# EAGLE design pcg_quad (EAGLE 9.6.2)
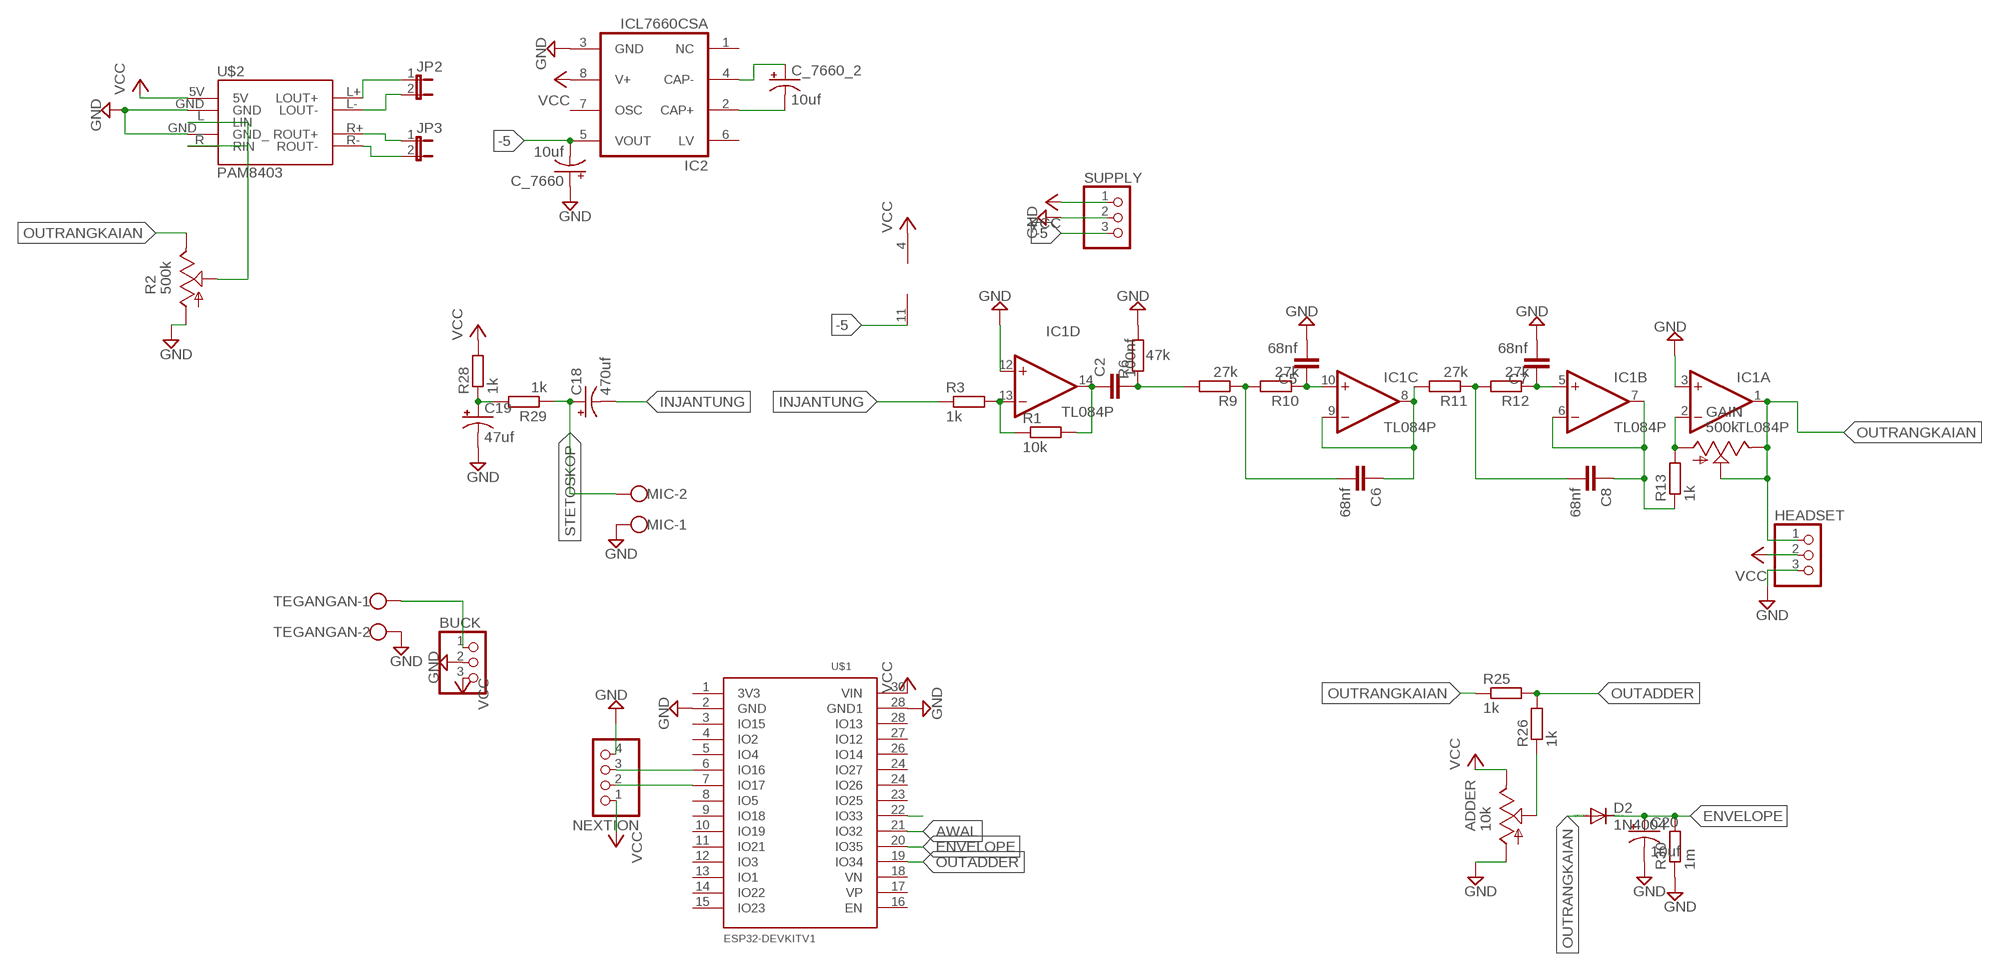
[diagram p0: schematic, sheet 1]

## Parts
ADDER  10k  TRIM_US-B64Y  [B64Y]
BUCK  PINHD-1X3  [1X03]
C2  100nf  C-EU050-025X075  [C050-025X075]
C5  68nf  C-EU050-025X075  [C050-025X075]
C6  68nf  C-EU050-025X075  [C050-025X075]
C7  68nf  C-EU050-025X075  [C050-025X075]
C8  68nf  C-EU050-025X075  [C050-025X075]
C18  470uf  CPOL-USE2.5-7  [E2,5-7]
C19  47uf  CPOL-USE2-5  [E2-5]
C20  10uf  CPOL-USE2-5  [E2-5]
C_7660  10uf  CPOL-USE2-5  [E2-5]
C_7660_2  10uf  CPOL-USE2-5  [E2-5]
D2  1N4004  [DO41-10]
GAIN  500k  TRIM_US-B64Y  [B64Y]
HEADSET  PINHD-1X3  [1X03]
IC1  TL084P  [DIL14]
IC2  ICL7660CSA  [SO08]
JP2  JP1E  [JP1]
JP3  JP1E  [JP1]
MIC  W237-102  [W237-102]
NEXTION  PINHD-1X4  [1X04]
R1  10k  R-EU_0309/10  [0309/10]
R2  500k  TRIM_US-B64Y  [B64Y]
R3  1k  R-EU_0309/10  [0309/10]
R6  47k  R-EU_0309/10  [0309/10]
R9  27k  R-EU_0309/10  [0309/10]
R10  27k  R-EU_0309/10  [0309/10]
R11  27k  R-EU_0309/10  [0309/10]
R12  27k  R-EU_0309/10  [0309/10]
R13  1k  R-EU_0309/10  [0309/10]
R25  1k  R-EU_0309/10  [0309/10]
R26  1k  R-EU_0309/10  [0309/10]
R28  1k  R-EU_0309/10  [0309/10]
R29  1k  R-EU_0309/10  [0309/10]
R30  1m  R-EU_0309/10  [0309/10]
SUPPLY  PINHD-1X3  [1X03]
TEGANGAN  W237-102  [W237-102]
U$1  ESP32DEVKITV1  [ESP32-DEVKITV1]
U$2  PAM8403  [PAM8403]

## Nets
-5: C_7660.- IC1.11(P:V-) IC2.5(VOUT) SUPPLY.3
AWAL: U$1.21(IO32)
ENVELOPE: C20.+ D2.C R30.2 U$1.20(IO35)
GND: ADDER.A BUCK.2 C5.2 C7.2 C19.- C20.- C_7660.+ HEADSET.3 IC1.3(A:+IN) IC1.12(D:+IN) IC2.3(GND) MIC.1 NEXTION.4 R2.A R6.2 R30.1 SUPPLY.2 TEGANGAN.2 U$1.2(GND) U$1.28(GND1) U$2.GND U$2.GND_
INJANTUNG: C18.- R3.1
N$1: IC1.13(D:-IN) R1.1 R3.2
N$2: C_7660_2.+ IC2.4(CAP-)
N$3: BUCK.1 TEGANGAN.1
N$4: R2.S U$2.L(LIN) U$2.R(RIN)
N$5: JP2.1 U$2.L+(LOUT+)
N$6: C_7660_2.- IC2.2(CAP+)
N$8: C2.2 R6.1 R9.2
N$9: NEXTION.3 U$1.6(IO16)
N$10: NEXTION.2 U$1.7(IO17)
N$11: JP2.2 U$2.L-(LOUT-)
N$12: JP3.1 U$2.R+(ROUT+)
N$13: C6.2 R9.1 R10.2
N$14: C5.1 IC1.10(C:+IN) R10.1
N$15: C6.1 IC1.8(C:OUT) IC1.9(C:-IN) R11.2
N$16: C8.2 R11.1 R12.2
N$17: C7.1 IC1.5(B:+IN) R12.1
N$18: C8.1 IC1.6(B:-IN) IC1.7(B:OUT) R13.1
N$19: GAIN.A IC1.2(A:-IN) R13.2
N$20: JP3.2 U$2.R-(ROUT-)
N$24: U$1.22(IO33)
N$38: ADDER.S R26.1
N$39: C19.+ R28.1 R29.2
OUTADDER: R25.2 R26.2 U$1.19(IO34)
OUTRANGKAIAN: D2.A GAIN.E GAIN.S HEADSET.1 IC1.1(A:OUT) R2.E R25.1
STETOSKOP: C18.+ MIC.2 R29.1
TEST: C2.1 IC1.14(D:OUT) R1.2
VCC: ADDER.E BUCK.3 HEADSET.2 IC1.4(P:V+) IC2.8(V+) NEXTION.1 R28.2 SUPPLY.1 U$1.30(VIN) U$2.5V
Unconnected: IC2.1(NC) IC2.6(LV) IC2.7(OSC) U$1.1(3V3) U$1.3(IO15) U$1.4(IO2) U$1.5(IO4) U$1.8(IO5) U$1.9(IO18) U$1.10(IO19) U$1.11(IO21) U$1.12(IO3) U$1.13(IO1) U$1.14(IO22) U$1.15(IO23) U$1.16(EN) U$1.17(VP) U$1.18(VN) U$1.23(IO25) U$1.24(IO26) U$1.24(IO27) U$1.26(IO14) U$1.27(IO12) U$1.28(IO13)

## Library data of the parts
ADDER GAIN R2 = pot:TRIM_US-: POTENTIOMETER
BUCK HEADSET SUPPLY = pinhead:PINHD-1X3: PIN HEADER
C2 C5-C8 = rcl:C-EU: CAPACITOR, European symbol; SPICEPREFIX: C
C18-C20 C_7660 C_7660_2 = rcl:CPOL-US: POLARIZED CAPACITOR, American symbol; SPICEPREFIX: C
D2 = diode:1N4004: DIODE general purpose rectifier, 1 A
IC1 = linear:TL084: OP AMP
IC2 = maxim:ICL7660CSA: VOLTAGE CONVERTER; MF: MAXIM; MPN: ICL7660CSA; OC_FARNELL: 9724710; OC_NEWARK: 34C3732
JP2 JP3 = jumper:JP1E: JUMPER
MIC TEGANGAN = con-wago-500:W237-102: WAGO SCREW CLAMP; MPN: 237-102; OC_FARNELL: unknown; OC_NEWARK: 70K9898
NEXTION = pinhead:PINHD-1X4: PIN HEADER
R1 R3 R6 R9-R13 R25 R26 R28-R30 = rcl:R-EU_: RESISTOR, European symbol; SPICEPREFIX: R
U$1 = ESP32-DEVKITV1:ESP32DEVKITV1
U$2 = pam8403:PAM8403

## Board
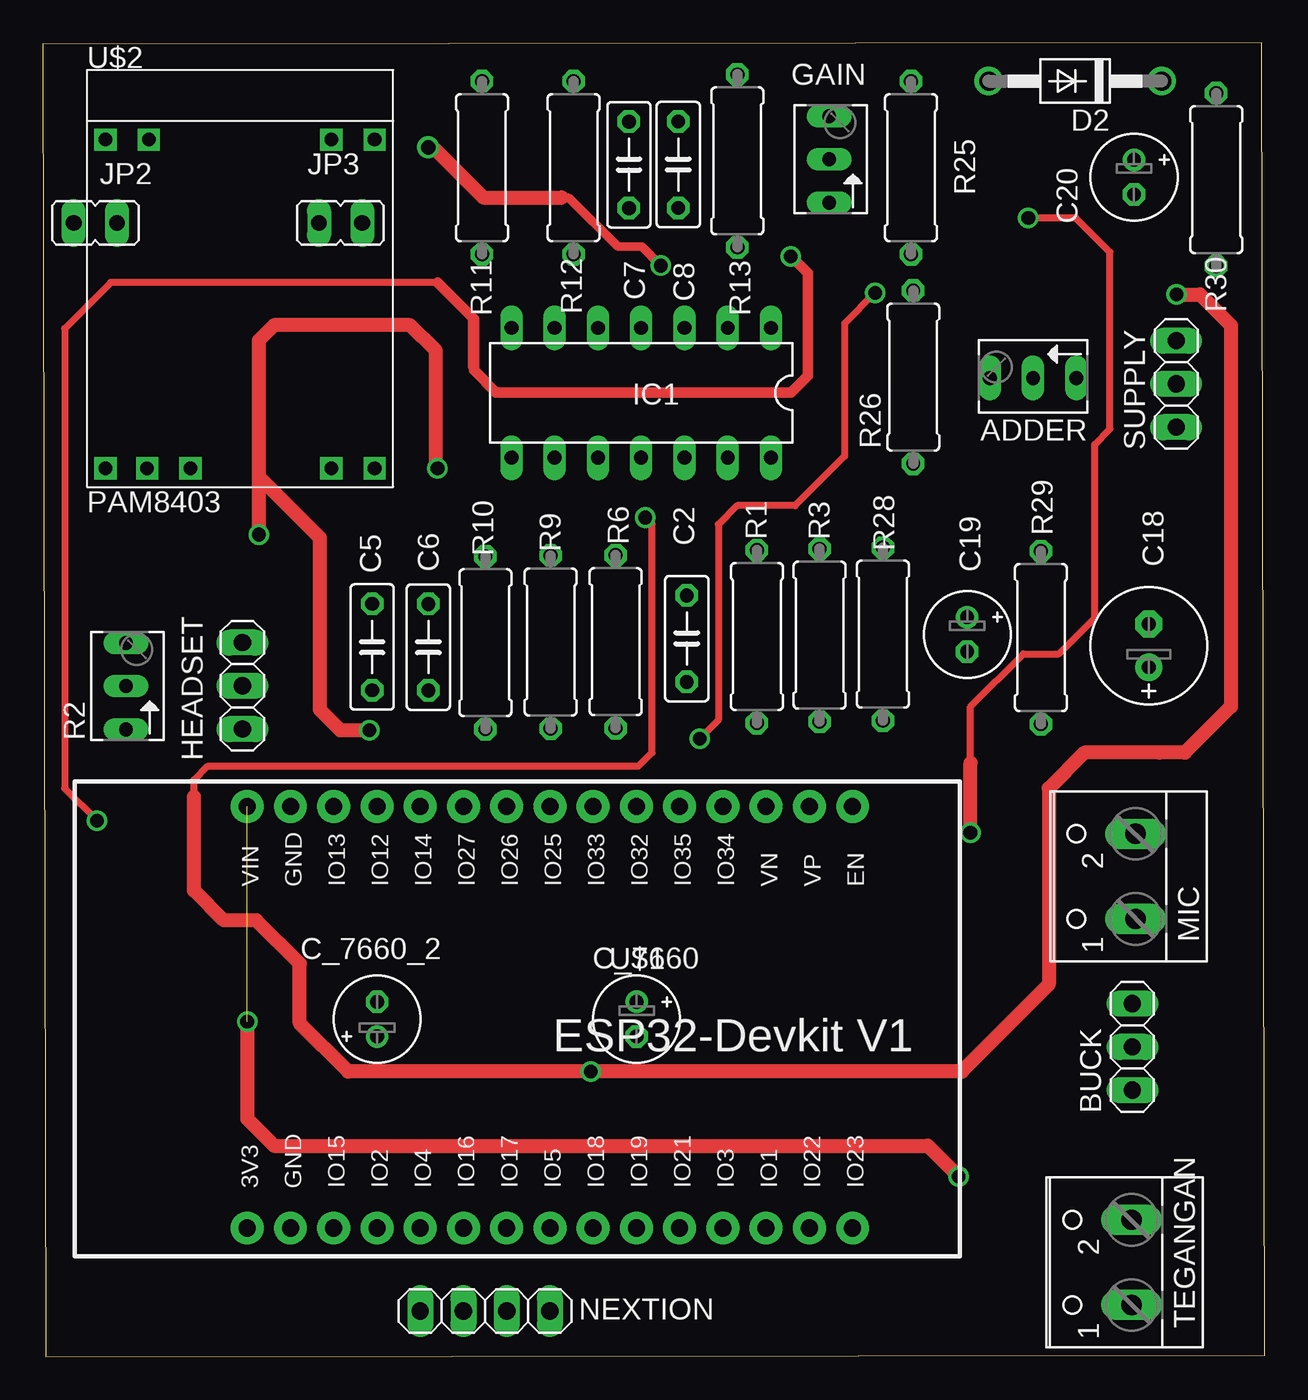
[diagram p1: board, top side]
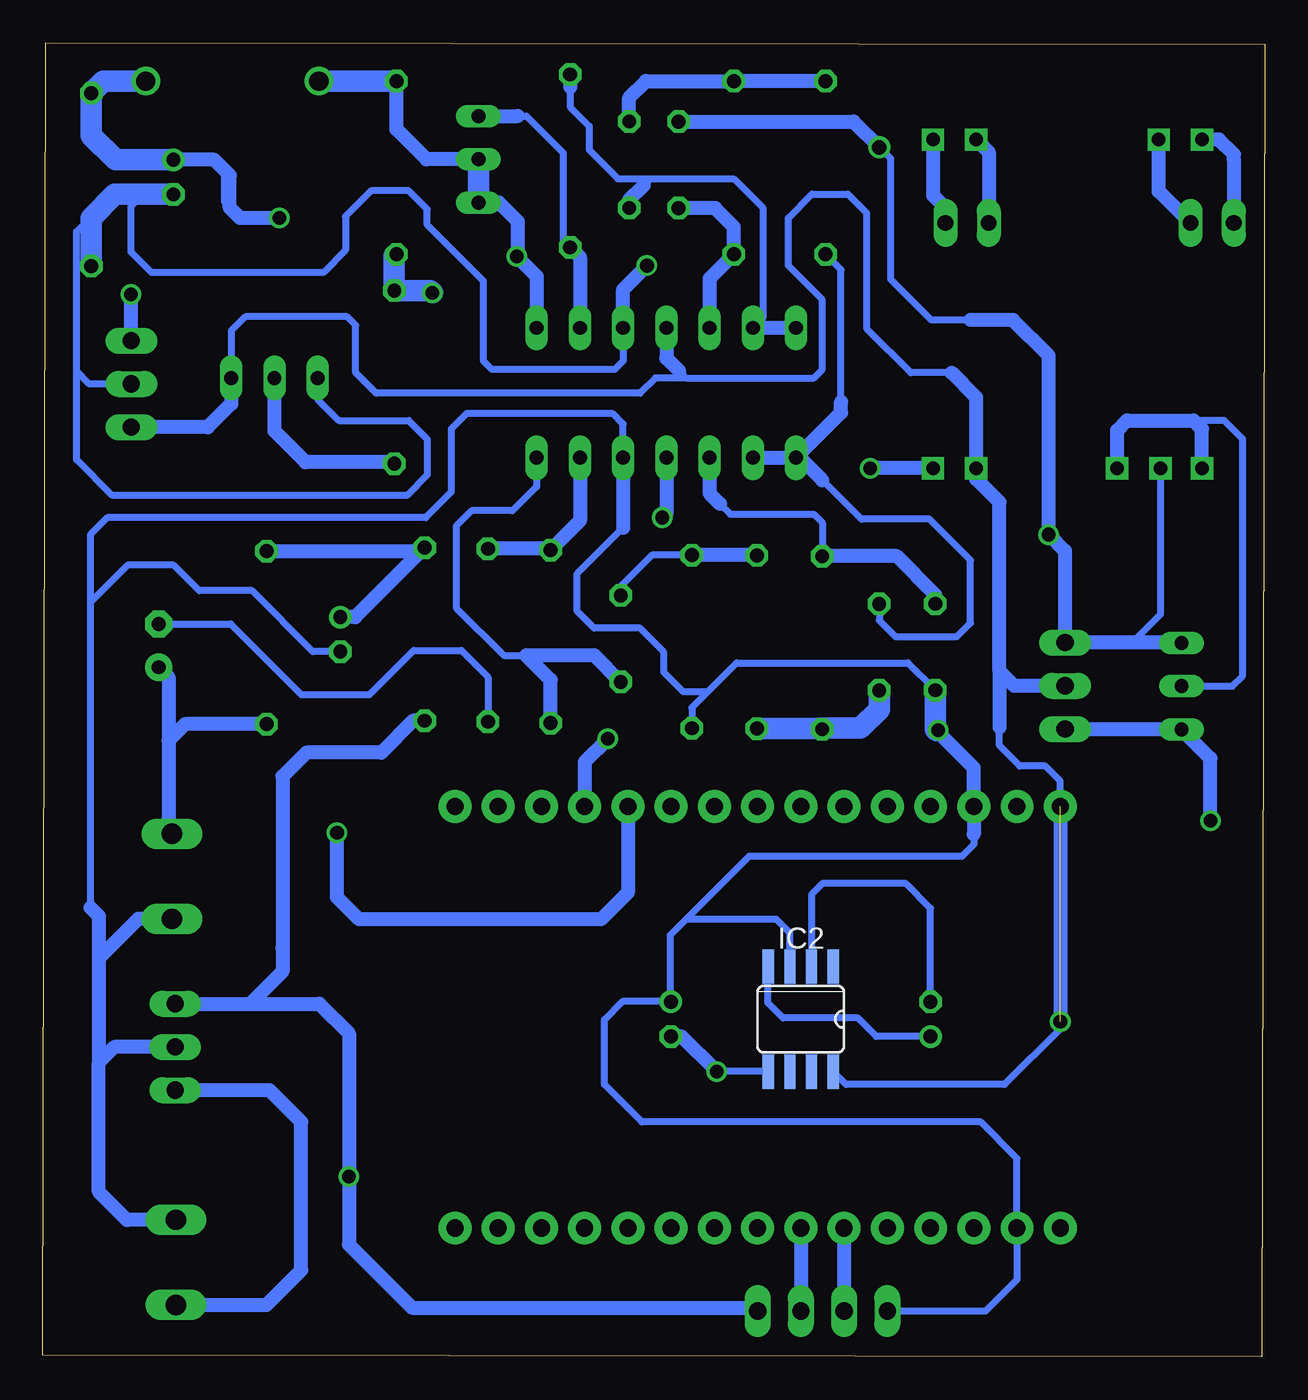
[diagram p2: board, bottom side, seen from below]

Size 71.8 x 77.2 mm. Coordinates in mm from the lower left corner, seen from the top.
Outline: 0.2,0 71.8,0.1 71.6,77.2 0,77.1 0.2,0
Copper layers (1*16): Top 0.035mm / dielectric 1.5mm / Bottom 0.035mm
Design rules "default": minimum track width 6mil, minimum drill 0.35mm, track to track 6mil, track to pad 6mil, pad to pad 6mil, via to via 6mil, smd to smd 6mil, copper to edge 40mil, drill to drill 6mil, minimum pad ring 10mil, minimum via ring 8mil, stop-mask expansion 4mil, vias tented up to drill 0mil, thermal gap 10mil

### Footprints (pad centres in the part's own frame; a part is rotated, then mirrored left to right if it is on the bottom)
B64Y = drill 0.813 long: A 2.54,0; E -2.54,0; S 0,0
1X03 = drill 1.016 long: 1 -2.54,0; 2 0,0; 3 2.54,0
C050-025X075 = drill 0.813 octagon: 1 -2.54,0; 2 2.54,0
E2,5-7 = drill 0.813 pad 1.6: + -1.27,0 | drill 0.813 pad 1.6 octagon: - 1.27,0
E2-5 = drill 0.813 pad 1.27: + -1.016,0 | drill 0.813 pad 1.27 octagon: - 1.016,0
DO41-10 = drill 1.118: A 5.08,0; C -5.08,0
DIL14 = drill 0.813 long: 1 -7.62,-3.81; 2 -5.08,-3.81; 3 -2.54,-3.81; 4 0,-3.81; 5 2.54,-3.81; 6 5.08,-3.81; 7 7.62,-3.81; 8 7.62,3.81; 9 5.08,3.81; 10 2.54,3.81; 11 0,3.81; 12 -2.54,3.81; 13 -5.08,3.81; 14 -7.62,3.81
SO08 = smd 0.66 x 2.032: 1 -1.905,-3.073; 2 -0.635,-3.073; 3 0.635,-3.073; 4 1.905,-3.073; 5 1.905,3.073; 6 0.635,3.073; 7 -0.635,3.073; 8 -1.905,3.073
JP1 = drill 0.914 long: 1 0,-1.27; 2 0,1.27
W237-102 = drill 1.194 long: 1 -2.5,-1.27; 2 2.5,-1.27
1X04 = drill 1.016 long: 1 -3.81,0; 2 -1.27,0; 3 1.27,0; 4 3.81,0
0309/10 = drill 0.813 octagon: 1 -5.08,0; 2 5.08,0
ESP32-DEVKITV1 = drill 1 pad 1.93: 1 -22.87,-13.54; 2 -20.33,-13.54; 3 -17.79,-13.54; 4 -15.25,-13.54; 5 -12.71,-13.54; 6 -10.17,-13.54; 7 -7.63,-13.54; 8 -5.09,-13.54; 9 -2.55,-13.54; 10 -0.01,-13.54; 11 2.53,-13.54; 12 5.07,-13.54; 13 7.61,-13.54; 14 10.15,-13.54; 15 12.69,-13.54; 16 12.69,11.23; 17 10.15,11.23; 18 7.61,11.23; 19 5.07,11.23; 20 2.53,11.23; 21 -0.01,11.23; 22 -2.55,11.23; 23 -5.09,11.23; 24 -7.63,11.23; 25 -10.17,11.23; 26 -12.71,11.23; 27 -15.25,11.23; 28 -17.79,11.23; 29 -20.33,11.23; 30 -22.87,11.23
PAM8403 = drill 0.8 square: 5V 4.36,-17.4; GND 6.9,-17.4; GND_ -6.46,-17.4; L -8.9,-17.4; L+ -6.36,1.9; L- -8.9,1.9; R -3.92,-17.4; R+ 4.36,1.9; R- 6.9,1.9

### Placement (x,y rotation side)
ADDER  58.18,57.5 180 top
BUCK  64.01,18.21 90 top
C2  37.84,42.19 90 top
C5  19.36,41.7 270 top
C6  22.66,41.69 270 top
C7  34.44,70.02 90 top
C8  37.34,70.03 90 top
C18  64.98,41.78 90 top
C19  54.31,42.44 270 top
C20  64.11,69.3 270 top
C_7660  34.89,19.84 270 top
C_7660_2  19.65,19.84 90 top
D2  60.65,74.94 180 top
GAIN  46.2,70.34 90 top
HEADSET  11.74,39.42 90 top
IC1  35.16,56.63 180 top
IC2  27.27,19.84 180 bottom
JP2  3.1,66.6 90 top
JP3  17.5,66.6 270 top
MIC  62.93,28.23 90 top
NEXTION  25.99,2.69 180 top
R1  41.96,42.31 270 top
R2  4.9,39.4 90 top
R3  45.64,42.39 90 top
R6  33.66,42.01 270 top
R9  29.84,41.99 90 top
R10  26.01,41.95 270 top
R11  25.81,69.85 270 top
R12  31.19,69.85 90 top
R13  40.81,70.25 270 top
R25  51.01,69.85 270 top
R26  51.14,57.55 90 top
R28  49.36,42.45 270 top
R29  58.64,42.25 90 top
R30  68.94,69.15 90 top
SUPPLY  66.59,57.15 90 top
TEGANGAN  62.69,5.55 90 top
U$1  34.89,21.11 0 top
U$2  12.6,69.6 0 top

### Tracks (layer width: path | path; a pad name or v marks a point on that pad's centre or on a via)
-5  (via drill 0.8)
  Top 0.406: v35.4,49.3 35.8,48.9 35.8,35.5 35,34.7 9.7,34.7 8.9,33.9 8.9,32.9
  Top 0.813: 8.9,32.9 8.9,27.4 10.65,25.65 12.55,25.65 15.1,23.1 15.1,19.6 17.93,16.77 v32.2,16.77 54,16.77 59.1,21.87 59.1,33.4 61.2,35.5 65.6,35.5 67.1,35.5 69.8,38.2 69.8,60.6 68,62.4 v66.6,62.4
  Bottom 0.406: IC2.5 v32.2,16.77 | v66.59,62.39 v66.6,62.4
  Bottom 0.813: SUPPLY.3 v66.59,62.39 | v32.2,16.77 34.26,18.82 C_7660.- | IC1.11 35.16,49.54 v35.4,49.3
ENVELOPE  (via drill 0.8)
  Top 0.406: 54.5,34.9 54.5,38.2 57.6,41.3 59.7,41.3 61.8,43.4 61.8,53.6 62.7,54.5 62.7,64.9 60.7,66.9 v57.9,66.9
  Top 0.813: v54.5,30.8 54.5,34.9
  Bottom 0.406: 60.8,67.5 61.1,67.8 61.1,69.7 61.6,70.2 61.72,70.32 | C20.+
  Bottom 0.813: U$1.20 37.42,27.28 39,25.7 53.2,25.7 54.5,27 v54.5,30.8 | v57.9,66.9 60.2,66.9 60.8,67.5 60.8,69.4 61.6,70.2 | 61.72,70.32 C20.+
  Bottom 1.27: D2.C 68.23,74.94 R30.2 68.94,71.74 67.52,70.32 C20.+
GND  (via drill 0.8, 0.85)
  Top 0.406: 12.95,51.45 12.7,51.7
  Top 0.508: v36.3,64.1 35.2,65.2 33.8,65.2 30.9,68.1 30.5,68.1
  Top 0.813: v23.2,52.2 23.1,52.3 23.1,59.1 21.6,60.6 13.6,60.6 12.7,59.7 12.7,51.7 v12.7,48.3 | v19.2,36.8 17.5,36.8 16.3,38 16.3,48.1 12.95,51.45 | v22.65,71.05 22.95,71.05 25.9,68.1 30.5,68.1
  Bottom 0.406: 34.93,20.9 37.7,20.9 38.8,19.8 38.8,16 36.6,13.8 16.7,13.8 14.56,11.66 U$1.2 14.56,4.54 16.41,2.69 NEXTION.4 | 34.93,20.9 C_7660.+ | IC2.3 27.91,24.9 28.7,25.7 34,25.7 | 34.93,20.9 34.93,24.77 34,25.7 | 17.1,30.7 17.1,30.1 17.8,29.4 30.3,29.4 34,25.7 | 68.35,17.45 68.5,17.3 | 68.5,23.4 68.5,18.6 | C19.- 55.92,41.42 59.5,45 62.6,45 64.1,46.5 66.8,46.5 69,44.3 | 69,44.3 69,26.4 | IC1.12 37.7,54.8 38.3,55.4 46.9,55.4 47.8,54.5 47.8,50.8 49.3,49.3 68,49.3 69,48.3 69,44.3 | C5.2 20.96,40.76 31.04,40.76 32.74,39.06 | R6.2 33.66,38.14 32.74,39.06 | 32.74,39.06 34.16,39.06 35.3,40.2 35.3,41.4 36.7,42.8 39.4,42.8 40.4,43.8 40.4,46 37.7,48.7 | 19.15,36.65 19.3,36.8 v19.2,36.8 | 4.92,41.96 7.8,41.96 | 7.8,41.96 HEADSET.3 | U$2.GND_ 6.14,43.62 7.8,41.96 | C20.- 65.9,68.28 | 65.9,68.28 67.62,68.28 68.94,66.96 | 68.94,66.96 68.94,66.9 | SUPPLY.2 69.05,57.15 69.8,57.9 | 69.8,57.9 69.8,66.1 68.94,66.96 | 17.3,60.9 19.6,60.9 22,63.3 22,70.4 v22.65,71.05 | IC1.3 37.7,58.5 38.2,58 45.4,58 45.9,58.5 45.9,63.2 49.2,66.5 49.2,67.4 50.3,68.5 52.5,68.5 54,67 54,65 55.3,63.7 65.4,63.7 66.6,64.9 66.6,67.58 65.9,68.28 | ADDER.A 55.64,56.24 54.4,55 50.3,55 49.2,53.9 49.2,51.8 50.4,50.6 67.7,50.6 69.8,52.7 69.8,57.9
  Bottom 0.813: U$2.GND v23.2,52.2 | 17.3,60.9 14.8,60.9 12.7,58.8 v12.7,48.3 11.74,47.34 HEADSET.3 4.92,41.96 R2.A | MIC.1 66.17,25.73 68.5,23.4 | 69,26.4 68.5,25.9 68.5,18.6 68.5,17.3 68.5,9.7 66.85,8.05 TEGANGAN.2 | IC1.3 37.7,62.7 v36.3,64.1 | C7.2 24.16,72.56 v22.65,71.05 | 17.1,30.7 U$1.28 17.1,34.6 19.15,36.65 | IC1.12 37.7,48.7 | BUCK.2 67.59,18.21 68.35,17.45
  Bottom 1.27: C20.- 67.56,68.28 68.94,66.9 R30.1 | C5.2 19.36,36.86 19.3,36.8
INJANTUNG
  Bottom 0.406: C18.- 60.75,43.05 56.6,38.9 52.6,38.9 50,41.5 47.2,41.5 45.64,39.94 R3.1
N$1
  Bottom 0.813: IC1.13 40.24,49.11 R1.1 42.04,47.47 R3.2
N$2
  Bottom 0.406: C_7660_2.+ 22.82,18.82 23.9,19.9 28.3,19.9 29.2,20.8 29.2,22.89 IC2.4
N$3
  Bottom 0.406: 58.47,15.67 58.7,15.67
  Bottom 0.813: TEGANGAN.1 58.65,3.05 56.6,5.1 56.6,13.8 58.47,15.67 | 58.7,15.67 BUCK.1
N$4
  Bottom 0.406: R2.S 1.92,39.4 1.31,40 1.31,53.91 2.4,55 4.2,55
  Bottom 0.813: U$2.L 3.7,54.5 4.2,55 8.1,55 8.68,54.42 U$2.R
N$5
  Bottom 0.813: JP2.1 6.24,68.47 U$2.L+
N$6
  Bottom 0.406: C_7660_2.- 19.65,26.35 21.1,27.8 26,27.8 26.64,27.16 IC2.2
N$8
  Bottom 0.406: R6.1 36.01,47.09 37.84,45.26 C2.2
  Bottom 0.813: R9.2 29.86,47.09 R6.1
N$9
  Bottom 0.813: U$1.6 NEXTION.3
N$10
  Bottom 0.406: 27.26,3 NEXTION.2
  Bottom 0.813: U$1.7 27.26,3
N$11
  Bottom 0.813: U$2.L- 2.7,71.5 1.83,70.63 1.83,70.27 1.83,70.1 JP2.2
N$12
  Bottom 0.813: U$2.R+ 16.23,70.77 JP3.1
N$13
  Bottom 0.406: R9.1 29.8,36.87 26.2,36.87 R10.2 25.84,36.7 24,36.7 23.75,36.95
  Bottom 1.27: C6.2 22.66,38.04 23.75,36.95 26.12,36.95 26.2,36.87 | R10.2 26.05,36.91 R9.1
N$14
  Bottom 0.406: R10.1 26,49 26.5,49.5 31.4,49.5 32,50.1
  Bottom 0.813: IC1.10 32.62,50.72 32,50.1 | C5.1 19.36,44.76 21.63,47.03 R10.1
N$15
  Bottom 0.406: R11.2 24.9,63.86 24.9,56.1 | C6.1 22.66,43.26 21.7,42.3 18.1,42.3 17.3,43.1 17.3,46.8 19.7,49.2 23.7,49.2 26,51.5
  Bottom 0.813: IC1.9 28.9,52.82 IC1.8 | IC1.8 24.9,55.46 24.9,56.1 | 26,51.5 27.32,52.82 IC1.8
N$16
  Bottom 0.406: R11.1 R12.2 31.4,74.93
  Bottom 0.813: R11.1 31.4,74.93 36.37,74.93 37.34,73.96 C8.2
N$17
  Bottom 0.813: IC1.5 32.62,63.34 R12.1 31.19,66.37 32.3,67.48 C7.1
N$18
  Bottom 0.406: 36.5,68.8 36.1,69.2 | 36.1,69.2 31.2,69.2 29.5,67.5 29.5,61.02 IC1.6 | 40.81,74.6 40.81,73.41 39.7,72.3 39.7,70.9 38,69.2 36.1,69.2
  Bottom 0.813: IC1.7 IC1.6 | C8.1 37.34,67.96 36.5,68.8 | R13.1 40.81,74.6
N$19
  Bottom 0.406: R13.2 41.22,65.58 41.22,70.72 43.38,72.88 43.9,72.88
  Bottom 0.813: GAIN.A 43.9,72.88 | R13.2 40.24,64.6 IC1.2
N$20
  Bottom 0.406: 18.77,67.5 JP3.2
  Bottom 0.813: U$2.R- 19.5,68.23 18.77,67.5
N$38
  Bottom 0.813: R26.1 51.22,52.55 56.35,52.55 58.18,54.38 ADDER.S
N$39
  Bottom 0.813: C19.+ 53.43,43.46 R28.1 49.56,47.33 R29.2
OUTADDER  (via drill 0.8)
  Top 0.406: v48.9,62.5 47.1,60.7 47.1,52.9 44.2,50 40.8,50 39.7,48.9 39.7,37.4 v38.6,36.3
  Bottom 0.813: v38.6,36.3 39.96,34.94 U$1.19
  Bottom 1.27: R25.2 51.14,64.64 R26.2 49.03,62.63 v48.9,62.5
OUTRANGKAIAN  (via drill 0.8)
  Top 0.406: v3.2,31.5 1.3,33.4 1.3,60.4 4,63.1 23.2,63.1 25.2,61.1 25.2,58.1 25.35,57.95
  Top 0.61: v43.95,64.65 44.95,63.65 44.95,57.65 43.95,56.65 26.65,56.65 25.35,57.95 25.35,60.95 23.2,63.1
  Bottom 0.406: 11.72,36.86 HEADSET.1
  Bottom 0.813: GAIN.S 49.25,70.34 51.01,72.1 R25.1 | 11.72,36.86 R2.E 3.2,35.16 v3.2,31.5 | GAIN.E 45,67.8 43.9,66.7 43.9,64.7 v43.95,64.65 42.78,63.48 IC1.1
  Bottom 1.27: R25.1 D2.A | GAIN.S GAIN.E
STETOSKOP
  Bottom 0.406: 64.4,30.93 MIC.2
  Bottom 0.813: C18.+ 64.4,39.93 64.4,36.2 | 64.4,36.2 64.4,30.93 | R29.1 63.43,37.17 64.4,36.2
TEST
  Bottom 0.406: IC1.14 42.78,51.12 44.2,49.7 46.6,49.7 47.5,48.8 47.5,44 44.7,41.2 43.4,41.2
  Bottom 0.813: R1.2 41.96,39.76 43.4,41.2 39.39,41.2 C2.1
VCC  (via drill 0.8)  (1 unrouted)
  Top 0.813: v12.02,19.7 12.02,13.98 13.6,12.4 52,12.4 v53.8,10.6
  Bottom 0.406: 12.02,19.6 12.02,19.28 15.3,16 24.6,16 IC2.8 | 59.65,20.75 BUCK.3 | 56.3,35.5 56.5,35.5 57.7,34.3 57.7,24 57.7,22.7 59.65,20.75 | U$1.30 12.02,33.82 12.9,34.7 14.4,34.7 15.6,35.9 15.6,37 | 34,57.5 26.5,57.5 26,58 26,62.1 28,64.1 28,66.9 26.6,68.3 24.5,68.3 23.4,67.2 23.4,60.4 20.8,57.8 18.4,57.8 | 34.4,57.9 34,57.5 | 34,57.5 35.8,57.5 36.7,56.6 52.2,56.6 53.4,57.8 53.4,60.6 53.9,61.1 59.9,61.1 60.72,60.28 ADDER.E | NEXTION.1 49.89,2.69 50.1,2.9 | 59.6,20.75 59.65,20.75
  Bottom 0.813: ADDER.E 60.72,55.99 62.1,54.61 SUPPLY.1 | NEXTION.1 30.01,2.9 50.1,2.9 53.8,6.6 v53.8,10.6 53.8,19 55.55,20.75 59.6,20.75 | IC1.4 35.16,58.66 34.4,57.9 | 18.4,57.8 16.96,56.36 U$2.5V 16.96,51.56 15.6,50.2 15.6,40.3 | HEADSET.2 14.72,39.42 15.6,40.3 | BUCK.3 59.6,20.75 | R28.2 50.03,37.37 51.9,35.5 56.3,35.5 57.7,34.1 57.7,24 57.7,22.65 59.6,20.75 | 15.6,40.3 15.6,37 | U$1.30 12.02,19.6